# Altium schematic sheet 05_ETHERNET.SchDoc
size A3; DocumentNumber: 5; SheetNumber: 5; SheetTotal: 5
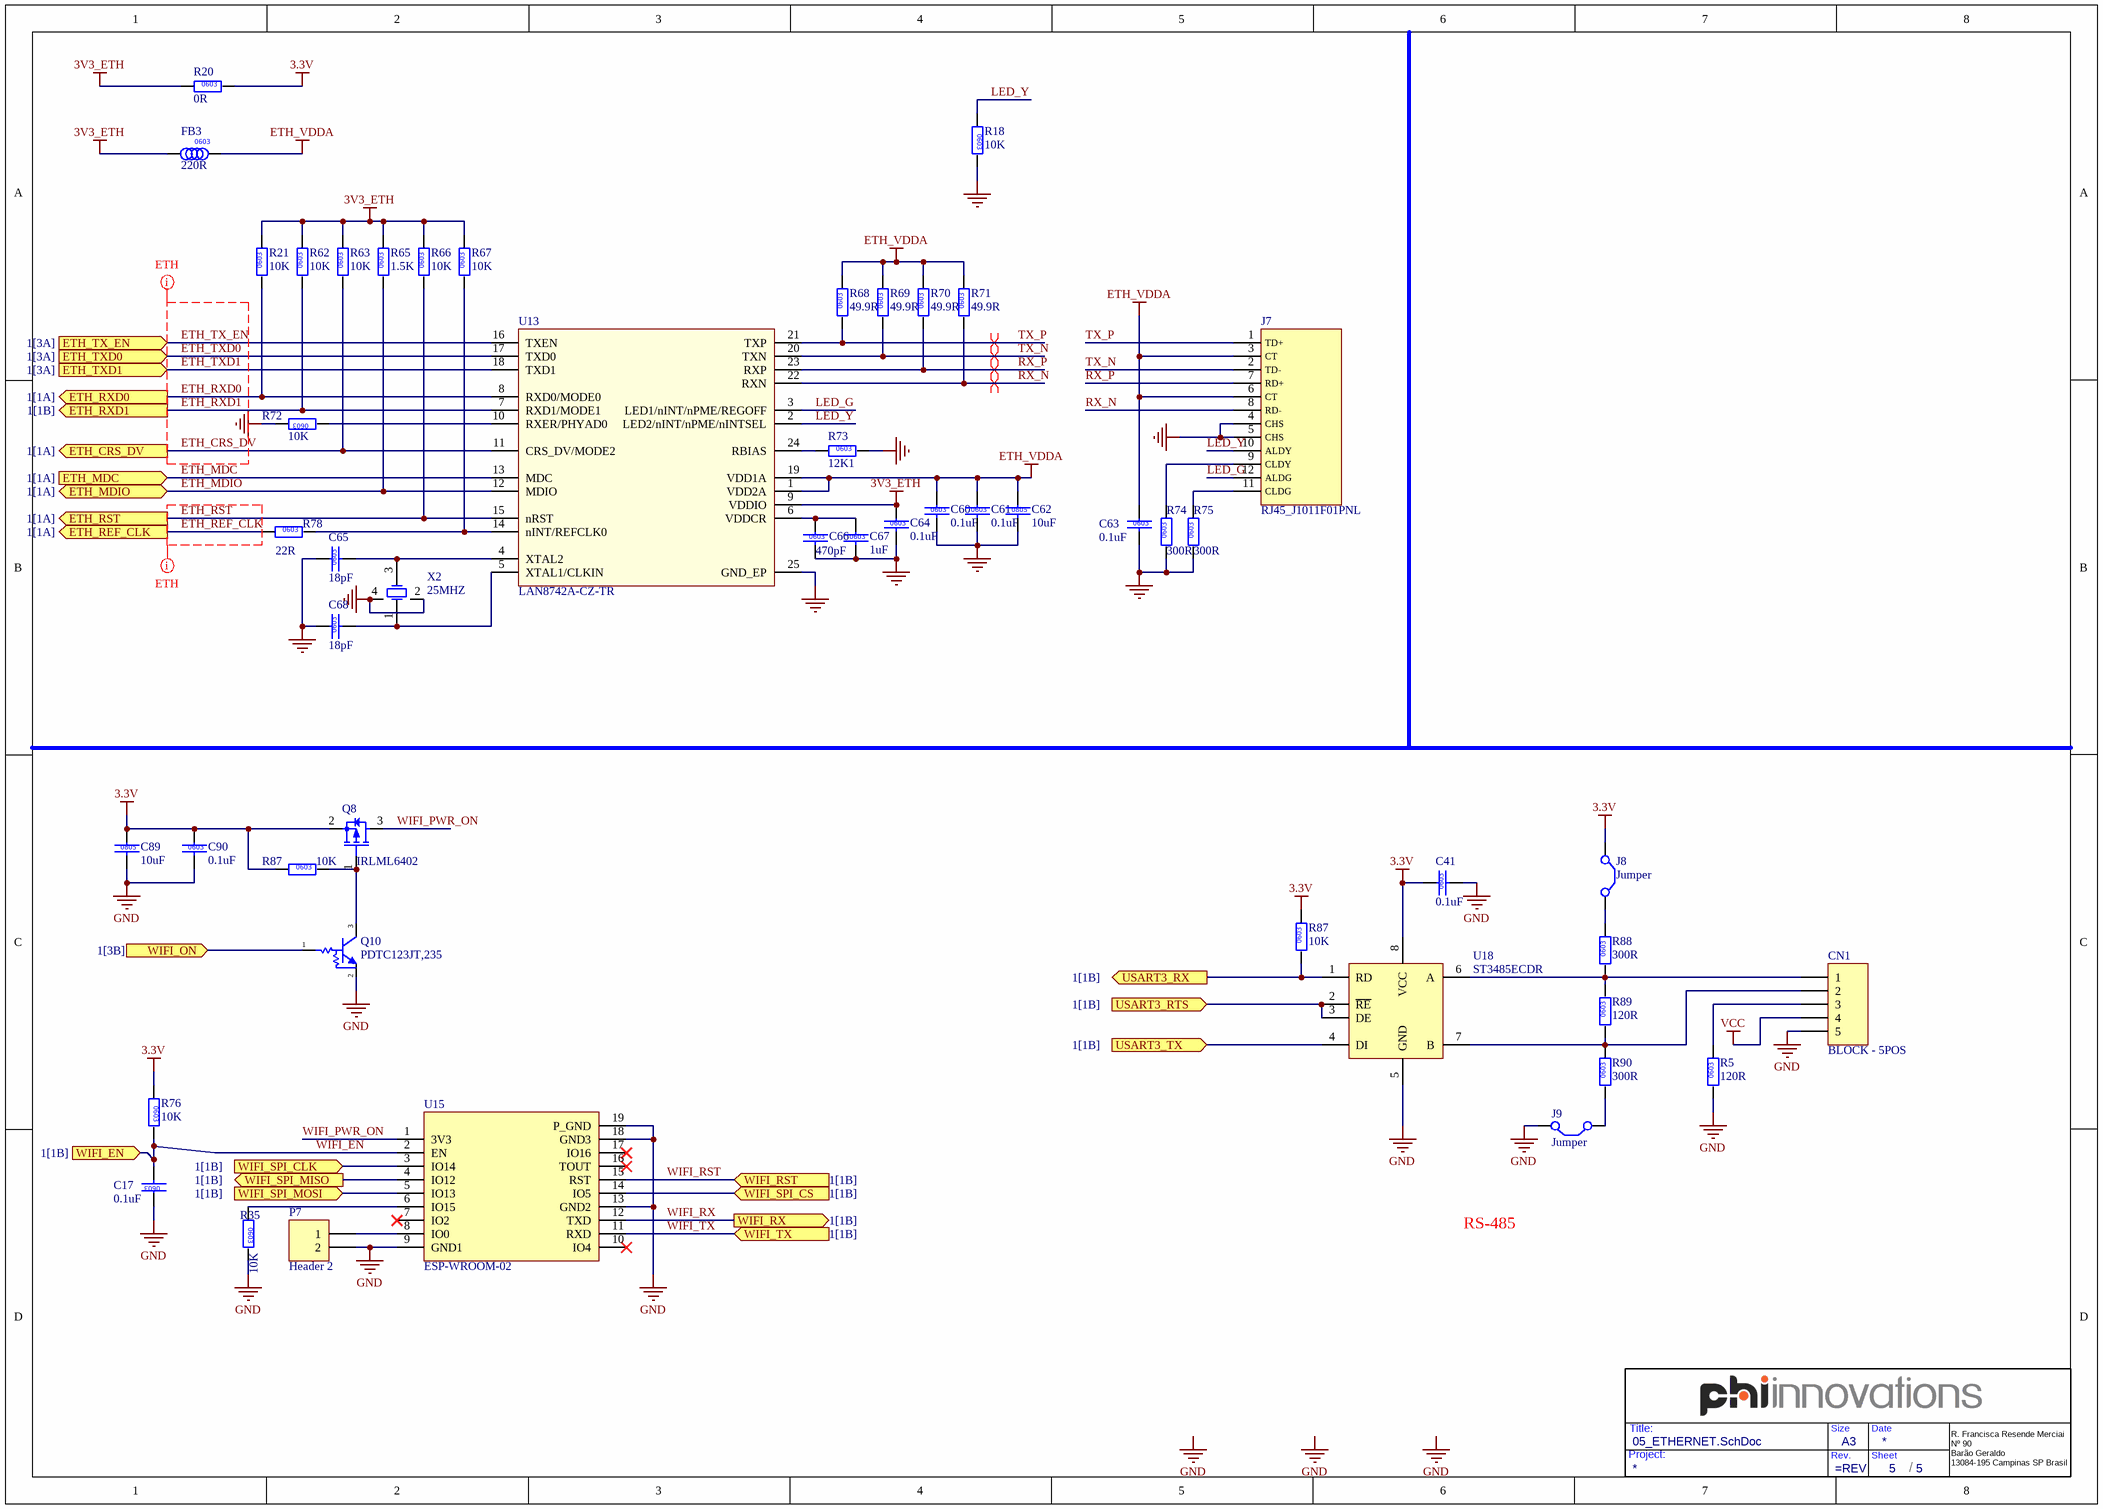
[diagram p0: 05_ETHERNET.SchDoc]

## Parts
(Parts that share a designator on the sheet are numbered #1, #2 ... from top to bottom, then left to right.)
?  (no value)  (graphical)
C17  0.1uF  [0603C]
C41  0.1uF  [0603C]
C60  0.1uF  [0603C]
C61  0.1uF  [0603C]
C62  10uF  [0805C]
C63  0.1uF  [0603C]
C64  0.1uF  [0603C]
C65  18pF  [0603C]
C66  470pF  [0603C]
C67  1uF  [0603C]
C68  18pF  [0603C]
C89  10uF  [C_0805]
C90  0.1uF  [C_0603]
CN1  BLOCK - 5POS  [CONN_BORNE_3.81_5POS]
FB3  220R  [0603L]
J7  RJ45_J1011F01PNL  [RJ45_J1011F01PNL]
J8  Jumper  [0805JP_C]  (net tie, no BOM)
J9  Jumper  [0805JP_C]  (net tie, no BOM)
P7  Header 2  [HDR1X2]  (no BOM)
Q8  IRLML6402  [SOT23-3]
Q10  PDTC123JT,235  [SOT23-3]
R5  120R  [0603R]
R18  10K  [0603R]
R20  0R  [0603R]
R21  10K  [0603R]
R35  10K  [0603R]
R62  10K  [0603R]
R63  10K  [0603R]
R65  1.5K  [0603R]
R66  10K  [0603R]
R67  10K  [0603R]
R68  49.9R  [0603R]
R69  49.9R  [0603R]
R70  49.9R  [0603R]
R71  49.9R  [0603R]
R72  10K  [0603R]
R73  12K1  [0603R]
R74  300R  [0603R]
R75  300R  [0603R]
R76  10K  [0603R]
R78  22R  [0603R]
R87#1  10K  [R_0603]
R87#2  10K  [0603R]
R88  300R  [0603R]
R89  120R  [0603R]
R90  300R  [0603R]
U13  LAN8742A-CZ-TR  [QFN50P400X400X80-24N]
U15  ESP-WROOM-02  [ESP-WROOM-02]
U18  ST3485ECDR  [SOIC8]
X2  25MHZ  [XTAL_4_50X32]

## Ports
ETH_CRS_DV (out, see 1[1A]), ETH_MDC (in, see 1[1A]), ETH_MDIO (bidir, see 1[1A]), ETH_REF_CLK (out, see 1[1A]), ETH_RST (out, see 1[1A]), ETH_RXD0 (out, see 1[1A]), ETH_RXD1 (out, see 1[1B]), ETH_TX_EN (in, see 1[3A]), ETH_TXD0 (in, see 1[3A]), ETH_TXD1 (in, see 1[3A]), USART3_RTS (in, see 1[1B]), USART3_RX (out, see 1[1B]), USART3_TX (in, see 1[1B]), WIFI_EN (in, see 1[1B]), WIFI_ON (in, see 1[3B]), WIFI_RST (in, see 1[1B]), WIFI_RX (out, see 1[1B]), WIFI_SPI_CLK (in, see 1[1B]), WIFI_SPI_CS (in, see 1[1B]), WIFI_SPI_MISO (out, see 1[1B]), WIFI_SPI_MOSI (in, see 1[1B]), WIFI_TX (in, see 1[1B])

## Nets
3.3V: C41.1 C89.1 C90.1 J8.1(C1) Q8.2(S) R20.2 R76.1 R87#1.1 R87#2.2 U18.8(VCC)
3V3_ETH: C64.1 FB3.1 R20.1 R21.2 R62.2 R63.2 R65.2 R66.2 R67.2 U13.9(VDDIO)
ETH_VDDA: C60.1 C61.1 C62.1 C63.1 FB3.2 J7.3(CT) J7.6(CT) R68.2 R69.2 R70.2 R71.2 U13.1(VDD2A) U13.19(VDD1A)
GND: C17.1 C41.2 C60.2 C61.2 C62.2 C63.2 C64.2 C65.1 C66.2 C67.2 C68.1 C89.2 C90.2 CN1.5 J7.4(CHS) J7.5(CHS) J9.2(C2) P7.2 Q10.2(E) R5.1 R18.2 R35.2 R72.2 R73.2 R74.1 R75.1 U13.25(GND_EP) U15.9(GND1) U15.13(GND2) U15.18(GND3) U15.19(P_GND) U18.5(GND) X2.2(GND) X2.4(GND)
VCC: CN1.4
ETH_CRS_DV: R63.1 U13.11(CRS_DV/MODE2) ; port ETH_CRS_DV
ETH_MDC: U13.13(MDC) ; port ETH_MDC
ETH_MDIO: R65.1 U13.12(MDIO) ; port ETH_MDIO
ETH_REF_CLK: R78.1 ; port ETH_REF_CLK
ETH_RST: R66.1 U13.15(nRST) ; port ETH_RST
ETH_RXD0: R21.1 U13.8(RXD0/MODE0) ; port ETH_RXD0
ETH_RXD1: R62.1 U13.7(RXD1/MODE1) ; port ETH_RXD1
ETH_TX_EN: U13.16(TXEN) ; port ETH_TX_EN
ETH_TXD0: U13.17(TXD0) ; port ETH_TXD0
ETH_TXD1: U13.18(TXD1) ; port ETH_TXD1
LED_G: J7.12(ALDG) U13.3(LED1/nINT/nPME/REGOFF)
LED_Y: J7.10(ALDY) R18.1 U13.2(LED2/nINT/nPME/nINTSEL)
RX_N: J7.8(RD-) R71.1 U13.22(RXN)
RX_P: J7.7(RD+) R70.1 U13.23(RXP)
TX_N: J7.2(TD-) R69.1 U13.20(TXN)
TX_P: J7.1(TD+) R68.1 U13.21(TXP)
USART3_RTS: U18.2(~{RE}) U18.3(DE) ; port USART3_RTS
USART3_RX: R87#2.1 U18.1(RD) ; port USART3_RX
USART3_TX: U18.4(DI) ; port USART3_TX
WIFI_EN: C17.2 R76.2 U15.2(EN) ; port WIFI_EN
WIFI_ON: Q10.1(B) ; port WIFI_ON
WIFI_PWR_ON: Q8.3(D) U15.1(3V3)
WIFI_RST: U15.15(RST) ; port WIFI_RST
WIFI_RX: U15.12(TXD) ; port WIFI_RX
WIFI_SPI_CLK: U15.3(IO14) ; port WIFI_SPI_CLK
WIFI_SPI_CS: U15.14(IO5) ; port WIFI_SPI_CS
WIFI_SPI_MISO: U15.4(IO12) ; port WIFI_SPI_MISO
WIFI_SPI_MOSI: U15.5(IO13) ; port WIFI_SPI_MOSI
WIFI_TX: U15.11(RXD) ; port WIFI_TX
NetC65_2: C65.2 U13.4(XTAL2) X2.3(OSC2)
NetC66_1: C66.1 C67.1 U13.6(VDDCR)
NetC68_2: C68.2 U13.5(XTAL1/CLKIN) X2.1(OSC1)
NetCN1_1: CN1.1 R88.1 R89.2 U18.6(A)
NetCN1_2: CN1.2 R89.1 R90.2 U18.7(B)
NetCN1_3: CN1.3 R5.2
NetJ7_9: J7.9(CLDY) R74.2
NetJ7_11: J7.11(CLDG) R75.2
NetJ8_2: J8.2(C2) R88.2
NetJ9_1: J9.1(C1) R90.1
NetP7_1: P7.1 U15.8(IO0)
NetQ8_1: Q8.1(G) Q10.3(C) R87#1.2
NetR35_1: R35.1 U15.6(IO15)
NetR67_1: R67.1 R78.2 U13.14(nINT/REFCLK0)
NetR72_1: R72.1 U13.10(RXER/PHYAD0)
NetR73_1: R73.1 U13.24(RBIAS)

Not connected (* = marked no-connect by the designer): U15 7(IO2)* 10(IO4)* 16(TOUT)* 17(IO16)*

## Layout directives
differential pair: RX_N, RX_P, TX_N, TX_P
net class Undefined: ETH_CRS_DV, ETH_REF_CLK, ETH_RST, ETH_RXD0, ETH_RXD1, ETH_TX_EN, ETH_TXD0, ETH_TXD1

## Notes on the sheet
- RS-485
- Labels drawn without touching a wire or pin: GND
- Project:
- Title:
- Rev.
- Size
- Sheet
- Date
- /
- R. Francisca Resende Merciai
  Nº 90
  Barão Geraldo
  13084-195 Campinas SP Brasil
- (in symbol PHI100.0.0603.000R.001.1/10W) 0603
- (in symbol PHI100.0.0603.01K5.001.1/10W) 0603
- (in symbol PHI100.0.0603.033R.001.1/10W) 0603
- (in symbol PHI100.0.0603.49R9.001.1/10W) 0603
- (in symbol PHI100.0.0603.120R.001.1/10W) 0603
- (in symbol PHI100.0.0603.300R.005.1/10W) 0603
- (in symbol PHI101.0.0603.010K.001.1/10W) 0603
- (in symbol PHI101.0.0603.12K1.001.1/10W) 0603
- (in symbol PHI201.0.0603.000u1.005.050V.X7R) 0603
- (in symbol PHI201.0.0603.0001u.010.025V.X5R) 0603
- (in symbol PHI201.0.0603.0018p.005.050V.C0G) 0603
- (in symbol PHI201.0.0603.0470p.010.050V.X7R) 0603
- (in symbol PHI201.0.0805.0010u.010.010V.X5R) 0805
- (in symbol PHI350.0.0603.0220R.XXX.0002A.050mOHM) 0603

## Library data of the parts
? = Title_Block3
C17 C60 C61 C63 C64 C90 = PHI201.0.0603.000u1.005.050V.X7R: CAP0603; Partnumber fabricante 1: 06035C104JAT2A; Fabricante 1: AVX Corporation; P Description: Capacitor ceramico 0603 0.1uF 20% 50V X7R; SCH Info: ETH; Partnumber PHI: PHI201.0.0603.000u1.005.050V.X7R; Datasheet fabricante 1: http://datasheets.avx.com/X7RDielectric.pdf; Distribuidor 1: Digi Key; PN distribuidor 1 / Fab 1: 478-5778-1-ND; Distribuidor 2: Mouser; Value: 0.1uF
C41 = PHI201.0.0603.000u1.005.050V.X7R: CAP0603; Partnumber fabricante 1: 06035C104JAT2A; Fabricante 1: AVX Corporation; P Description: Capacitor ceramico 0603 0.1uF 20% 50V X7R; SCH Info: MODBUS; Partnumber PHI: PHI201.0.0603.000u1.005.050V.X7R; Datasheet fabricante 1: http://datasheets.avx.com/X7RDielectric.pdf; Distribuidor 1: Digi Key; PN distribuidor 1 / Fab 1: 478-5778-1-ND; Distribuidor 2: Mouser; Value: 0.1uF
C62 C89 = PHI201.0.0805.0010u.010.010V.X5R: CAP0805; Partnumber fabricante 1: 0805ZD106MAT2A; Fabricante 1: AVX Corporation; P Description: Capacitor ceramico 0805 10uF 10% 10V X5R; Partnumber PHI: PHI201.0.0805.0010u.010.010V.X5R; Datasheet fabricante 1: http://datasheets.avx.com/cx5r.pdf; Distribuidor 1: Digi Key; PN distribuidor 1 / Fab 1: 478-5326-1-ND; Distribuidor 2: Mouser; Value: 10uF
C65 C68 = PHI201.0.0603.0018p.005.050V.C0G: CAP0603; Partnumber fabricante 1: GRM1885C1H180JA01D; Fabricante 1: Murata Electronics North America; P Description: Capacitor ceramico 0603 18pF 5% 50V C0G; SCH Info: ETH; Partnumber PHI: PHI201.0.0603.0018p.005.050V.C0G; Datasheet fabricante 1: http://www.murata.com/~/media/webrenewal/support/library/catalog/products/capacitor/mlcc/c02e.pdf; Distribuidor 1: Digi Key; PN distribuidor 1 / Fab 1: 490-1409-1-ND; Distribuidor 2: Mouser; Value: 18pF
C66 = PHI201.0.0603.0470p.010.050V.X7R: CAP0603; Partnumber fabricante 1: C0603C471K5RACTU; Fabricante 1: Kemet; P Description: Capacitor ceramico 0603 470pF 10% 50V X7R; SCH Info: ETH; Partnumber PHI: PHI201.0.0603.0470p.010.050V.X7R; Datasheet fabricante 1: http://www.kemet.com/Lists/ProductCatalog/Attachments/53/KEM_C1002_X7R_SMD.pdf; Distribuidor 1: Digi Key; PN distribuidor 1 / Fab 1: 399-1075-1-ND; Distribuidor 2: Mouser; Value: 470pF
C67 = PHI201.0.0603.0001u.010.025V.X5R: CAP0603; Partnumber fabricante 1: GRM188R61E105KA12D; Fabricante 1: Murata Electronics North America; Fabricante 2: Samsung Electro-Mechanics America, Inc.; P Description: Capacitor ceramico 0603 1uF 5% 25V X5R; SCH Info: ETH; Partnumber PHI: PHI201.0.0603.0001u.010.025V.X5R; Datasheet fabricante 1: http://www.murata.com/~/media/webrenewal/support/library/catalog/products/capacitor/mlcc/c02e.pdf; Partnumber fabricante 2: CL10A105KA5LNNC; Datasheet fabricante 2: http://www.samsungsem.com/kr/front/downloadcms.do?path=/kr/support/product-search/mlcc/__icsFiles/afieldfile/2014/11/05&fileName=C_CL10A105KA5LNNC.pdf; Distribuidor 1: Digi Key; PN distribuidor 1 / Fab 1: 490-3897-1-ND; PN distribuidor 1 / Fab 2: 1276-1858-1-ND; Distribuidor 2: Mouser; Value: 1uF
CN1 = PHI740.1.M.OSTOQ053251: HEADER_5; Fabricante 1: On Shore Technology Inc.; P Description: TERM BLOCK HDR 5POS 90DEG 3.81MM; SCH Info: MODBUS; Partnumber PHI: PHI740.1.M.OSTOQ053251; Partnumber fabricante 1: OSTOQ053251; Datasheet fabricante 1: http://www.on-shore.com/wp-content/uploads/2015/09/ostoqxx3251.pdf; Distribuidor 1: Digi Key; PN distribuidor 1 / Fab 1: ED2811-ND; Distribuidor 2: Mouser; Value: BLOCK - 5POS
FB3 = PHI350.0.0603.0220R.XXX.0002A.050mOHM: FB0603; Partnumber fabricante 1: BLM18EG221SN1D; Fabricante 1: Murata Electronics North America; P Description: Ferrite Bead Chip 0603 220OHM 2A 50mOHM; SCH Info: ETH; Partnumber PHI: PHI350.0.0603.0220R.XXX.0002A.050mOHM; Datasheet fabricante 1: http://search.murata.co.jp/Ceramy/image/img/PDF/ENG/L0110S0101BLM18E.pdf; Distribuidor 1: Digi Key; PN distribuidor 1 / Fab 1: 490-3992-1-ND; Distribuidor 2: Mouser; Value: 220R
J7 = PHI730.1.X.J1011F01PNL: CONN MAGJACK 1PORT 100 BASE-TX; Fabricante 1: Pulse Eletronics; Value: RJ45_J1011F01PNL; Partnumber PHI: PHI730.1.X.J1011F01PNL; Partnumber fabricante 1: J1011F01PNL; Distribuidor 1: Digi Key; PN distribuidor 1 / Fab 1: 553-1350-ND; Distribuidor 2: Mouser; P Description: CONN MAGJACK 1PORT 100 BASE-T
J8 J9 = Jumper: Jumper SMD; SCH Info: MODBUS
P7 = Header 2: Header, 2-Pin; Partnumber fabricante 1: Header 2.54mm; SCH Info: WIFI
Q8 = PHI500.0.IRLML6402TRPBF: P-Channel MOSFET; Fabricante 1: Infineon Technologies Americas Corp; P Description: MOSFET P CH SOT-23 20V 3.7A; SCH Info: GERAL; Partnumber PHI: PHI500.0.IRLML6402TRPBF; Partnumber fabricante 1: IRLML6402TRPBF; Datasheet fabricante 1: http://www.irf.com/product-info/datasheets/data/irlml6402pbf.pdf; Distribuidor 1: Digi Key; PN distribuidor 1 / Fab 1: IRLML6402PBFCT-ND; Distribuidor 2: Mouser; Value: IRLML6402
Q10 = PHI530.0.PDTC123JT,235: BJT_PB_NPN_SOT23-3; Fabricante 1: NXP Semiconductors; P Description: TRANS PREBIAS NPN 250MW TO236AB; SCH Info: GERAL; Partnumber PHI: PHI530.0.PDTC123JT,235; Partnumber fabricante 1: PDTC123JT,235; Datasheet fabricante 1: http://www.nxp.com/documents/data_sheet/PDTC123J_SER.pdf; Distribuidor 1: Digi Key; PN distribuidor 1 / Fab 1: 568-2154-1-ND; Distribuidor 2: Mouser; Value: PDTC123JT,235
R5 R89 = PHI100.0.0603.120R.001.1/10W: RES0603; Partnumber fabricante 1: RC0603FR-07120RL; Fabricante 1: Yageo; P Description: Resistor SMD 0603 120R 1% 1/16W; SCH Info: MODBUS; Partnumber PHI: PHI100.0.0603.120R.001.1/10W; Datasheet fabricante 1: http://www.yageo.com.tw/exep/pages/download/literatures/PYu-R_INT-thick_7.pdf; Distribuidor 1: Digi Key; PN distribuidor 1 / Fab 1: 311-120HRCT-ND; Distribuidor 2: Mouser; Value: 120R
R18 R21 R35 R62 R63 R66 R67 R72 R76 = PHI101.0.0603.010K.001.1/10W: RES0603; Partnumber fabricante 1: RC0603FR-0710KL; Fabricante 1: Yageo; Fabricante 2: Stackpole Electronics Inc; P Description: Resistor SMD 0603 10K 1% 1/08W; SCH Info: ETH; Partnumber PHI: PHI101.0.0603.010K.001.1/10W; Datasheet fabricante 1: http://www.yageo.com/documents/recent/PYu-RC_Group_51_RoHS_L_04.pdf; Partnumber fabricante 2: RNCP0603FTD10K0; Datasheet fabricante 2: http://www.seielect.com/catalog/SEI-RNCP.pdf; Distribuidor 1: Digi Key; PN distribuidor 1 / Fab 1: 311-10.0KHRCT-ND; PN distribuidor 1 / Fab 2: RMCF0603FT10K0CT-ND; Distribuidor 2: Mouser; Value: 10K
R20 = PHI100.0.0603.000R.001.1/10W: RES0603; Partnumber fabricante 1: RC0603JR-070RL; Fabricante 1: Yageo; Fabricante 2: Panasonic Electronic Components; P Description: Resistor SMD 0603 0R JUMPER 1/10W; SCH Info: ETH; Partnumber PHI: PHI100.0.0603.000R.001.1/10W; Datasheet fabricante 1: http://www.yageo.com/NewPortal/yageodocoutput?fileName=/pdf/R-Chip/PYu-RC_Group_51_RoHS_L_3.pdf; Partnumber fabricante 2: ERJ-3GEY0R00V; Datasheet fabricante 2: http://industrial.panasonic.com/www-cgi/jvcr13pz.cgi?E+PZ+3+AOA0001+ERJ3GEY0R00V+7+WW; Distribuidor 1: Digi Key; PN distribuidor 1 / Fab 1: 311-0.0GRCT-ND; PN distribuidor 1 / Fab 2: P0.0GTR-ND; Distribuidor 2: Mouser; Value: 0R
R65 = PHI100.0.0603.01K5.001.1/10W: RES0603; Partnumber fabricante 1: RC0603FR-071K5L; Fabricante 1: Yageo; Fabricante 2: Stackpole Electronics Inc; P Description: Resistor SMD 0603 1.5K 1% 1/10W; SCH Info: ETH; Partnumber PHI: PHI100.0.0603.01K5.001.1/10W; Datasheet fabricante 1: http://www.yageo.com/NewPortal/yageodocoutput?fileName=/pdf/R-Chip/PYu-RC_Group_51_RoHS_L_3.pdf; Partnumber fabricante 2: RMCF0603FT1K50; Datasheet fabricante 2: http://www.seielect.com/Catalog/SEI-RMCF_RMCP.pdf; Distribuidor 1: Digi Key; PN distribuidor 1 / Fab 1: 311-1.50KHRCT-ND; PN distribuidor 1 / Fab 2: RMCF0603FT1K50CT-ND; Distribuidor 2: Mouser; Value: 1.5K
R68-R71 = PHI100.0.0603.49R9.001.1/10W: RES0603; Partnumber fabricante 1: RC0603FR-0749R9L; Fabricante 1: Yageo; Fabricante 2: Panasonic Electronic Components; P Description: Resistor SMD 0603 49.9R 1% 1/16W; SCH Info: ETH; Partnumber PHI: PHI100.0.0603.49R9.001.1/10W; Datasheet fabricante 1: http://www.yageo.com/NewPortal/yageodocoutput?fileName=/pdf/R-Chip/PYu-RC_Group_51_RoHS_L_3.pdf; Partnumber fabricante 2: ERJ-3EKF49R9V; Datasheet fabricante 2: http://industrial.panasonic.com/www-cgi/jvcr13pz.cgi?E+PZ+3+AOA0001+ERJ3GEYJ102V+7+WW; Distribuidor 1: Digi Key; PN distribuidor 1 / Fab 1: 311-49.9HRCT-ND; PN distribuidor 1 / Fab 2: P49.9HCT-ND; Distribuidor 2: Mouser; Value: 49.9R
R73 = PHI101.0.0603.12K1.001.1/10W: RES0603; Partnumber fabricante 1: RC0603FR-0712K1L; Fabricante 1: Yageo; P Description: Resistor SMD 0603 10K 1% 1/08W; SCH Info: ETH; Partnumber PHI: PHI101.0.0603.12K1.001.1/10W; Datasheet fabricante 1: http://www.yageo.com.tw/exep/pages/download/literatures/PYu-R_INT-thick_7.pdf; Distribuidor 1: Digi Key; PN distribuidor 1 / Fab 1: 311-12.1KHRCT-ND; Distribuidor 2: Mouser; Value: 12K1
R74 R75 = PHI100.0.0603.300R.005.1/10W: RES0603; Partnumber fabricante 1: RC0603JR-07300RL; Fabricante 1: Yageo; P Description: Resistor SMD 0603 300R 5% 1/10W; SCH Info: ETH; Partnumber PHI: PHI100.0.0603.300R.005.1/10W; Datasheet fabricante 1: http://www.yageo.com.tw/exep/pages/download/literatures/PYu-R_INT-thick_7.pdf; Distribuidor 1: Digi Key; PN distribuidor 1 / Fab 1: 311-300GRTR-ND; Value: 300R
R78 = PHI100.0.0603.033R.001.1/10W: RES0603; Partnumber PHI: PHI100.0.0603.022R.001.1/10W; Partnumber fabricante 1: RC0603FR-0722RL; Fabricante 1: Yageo; P Description: Resistor SMD 0603 22R 1% 1/10W; Fabricante 2: Stackpole Electronics Inc; SCH Info: ETH; Datasheet fabricante 1: http://www.yageo.com/NewPortal/yageodocoutput?fileName=/pdf/R-Chip/PYu-RC_Group_51_RoHS_L_3.pdf; Distribuidor 1: Digi Key; PN distribuidor 1 / Fab 1: 311-22.0HRCT-ND; Distribuidor 2: Mouser; Value: 22R; Datasheet fabricante 2: http://www.seielect.com/Catalog/SEI-RMCF_RMCP.pdf; Partnumber fabricante 2: RMCF0603FT22R0; PN distribuidor 1 / Fab 2: RMCF0603FT22R0CT-ND
R87#1 = PHI101.0.0603.010K.001.1/10W: RES0603; Partnumber fabricante 1: RC0603FR-0710KL; Fabricante 1: Yageo; Fabricante 2: Stackpole Electronics Inc; P Description: Resistor SMD 0603 10K 1% 1/08W; SCH Info: 2G/3G; Partnumber PHI: PHI101.0.0603.010K.001.1/10W; Datasheet fabricante 1: http://www.yageo.com/documents/recent/PYu-RC_Group_51_RoHS_L_04.pdf; Partnumber fabricante 2: RNCP0603FTD10K0; Datasheet fabricante 2: http://www.seielect.com/catalog/SEI-RNCP.pdf; Distribuidor 1: Digi Key; PN distribuidor 1 / Fab 1: 311-10.0KHRCT-ND; PN distribuidor 1 / Fab 2: RMCF0603FT10K0CT-ND; Distribuidor 2: Mouser; Value: 10K
R87#2 = PHI101.0.0603.010K.001.1/10W: RES0603; Partnumber fabricante 1: RC0603FR-0710KL; Fabricante 1: Yageo; Fabricante 2: Stackpole Electronics Inc; P Description: Resistor SMD 0603 10K 1% 1/08W; SCH Info: MODBUS; Partnumber PHI: PHI101.0.0603.010K.001.1/10W; Datasheet fabricante 1: http://www.yageo.com/documents/recent/PYu-RC_Group_51_RoHS_L_04.pdf; Partnumber fabricante 2: RNCP0603FTD10K0; Datasheet fabricante 2: http://www.seielect.com/catalog/SEI-RNCP.pdf; Distribuidor 1: Digi Key; PN distribuidor 1 / Fab 1: 311-10.0KHRCT-ND; PN distribuidor 1 / Fab 2: RMCF0603FT10K0CT-ND; Distribuidor 2: Mouser; Value: 10K
R88 R90 = PHI100.0.0603.300R.005.1/10W: RES0603; Partnumber fabricante 1: RC0603JR-07300RL; Fabricante 1: Yageo; P Description: Resistor SMD 0603 300R 5% 1/10W; SCH Info: MODBUS; Partnumber PHI: PHI100.0.0603.300R.005.1/10W; Datasheet fabricante 1: http://www.yageo.com.tw/exep/pages/download/literatures/PYu-R_INT-thick_7.pdf; Distribuidor 1: Digi Key; PN distribuidor 1 / Fab 1: 311-300GRTR-ND; Value: 300R
U13 = PHI800.0.LAN8742A-CZ-TR: LAN8742A-CZ-TR - Small Footprint RMII 10/100 Ethernet, Transceiver with HP Auto-MDIX and flexPWR Technology SQFN-24; Fabricante 1: Microchip Technology; P Description: IC TXRX ETHERNET 100MBPS 24QFN; Value: ENC28J60; SCH Info: ETH; Partnumber PHI: PHI800.0.LAN8742A-CZ-TR; Partnumber fabricante 1: LAN8742A-CZ-TR; Datasheet fabricante 1: http://ww1.microchip.com/downloads/en/DeviceDoc/8742a.pdf; Distribuidor 1: Digi Key; PN distribuidor 1 / Fab 1: LAN8742A-CZ-TR-ND
U15 = PHI800.0.ESP-WROOM-02: Fabricante 1: ESPRESSIF; P Description: TXRX ESP8266 MOD WIFI TRACE ANT; Partnumber PHI: PHI800.0.ESP-WROOM-02; Partnumber fabricante 1: ESP-WROOM-02; Datasheet fabricante 1: http://espressif.com/en/products/hardware/esp-wroom-02/resources; Distribuidor 1: Digi Key; PN distribuidor 1 / Fab 1: 1597-1397-1-ND; Value: ESP-WROOM-02
U18 = PHI800.0.ST3485ECDR: Fabricante 1: STMicroeletronics; P Description: IC TXRX RS485/422 250KBPS 8-SOIC; Value: ST3485ECDR; Partnumber PHI: PHI800.0.ST3485ECDR; Partnumber fabricante 1: ST3485ECDR; Datasheet fabricante 1: http://www.st.com/content/ccc/resource/technical/document/datasheet/be/f4/e5/fd/b0/df/40/72/CD00003137.pdf/files/CD00003137.pdf/jcr:content/translations/en.CD00003137.pdf; Distribuidor 1: Digi Key; PN distribuidor 1 / Fab 1: 497-6540-1-ND; Distribuidor 2: Mouser
X2 = PHI600.0.ABM3B-25.000MHZ-B2-T: Crystal 8.0000MHz 20ppm 18pF 200 Ohm -20°C - 70°C Surface Mount 4-SMD, No Lead (DFN, LCC); Manufacturer: Abracon LLC; Part Number: ABM3B-8.000MHZ-B2-T; P Description: Cristal 4-SMD 18pF ±20ppm 25.000MHZ; SCH Info: ETH; Supplier 1: Digi-Key; Supplier Part Number 1: 535-9720-1-ND; Value: 25MHZ; Partnumber PHI: PHI600.0.ABM3B-25.000MHZ-B2-T; Fabricante 1: Abracon LLC; Partnumber fabricante 1: ABM3B-25.000MHZ-B2-T; Datasheet fabricante 1: http://www.abracon.com/Resonators/abm3b.pdf; Distribuidor 1: Digi Key; PN distribuidor 1 / Fab 1: 535-9128-1-ND; Distribuidor 2: Mouser